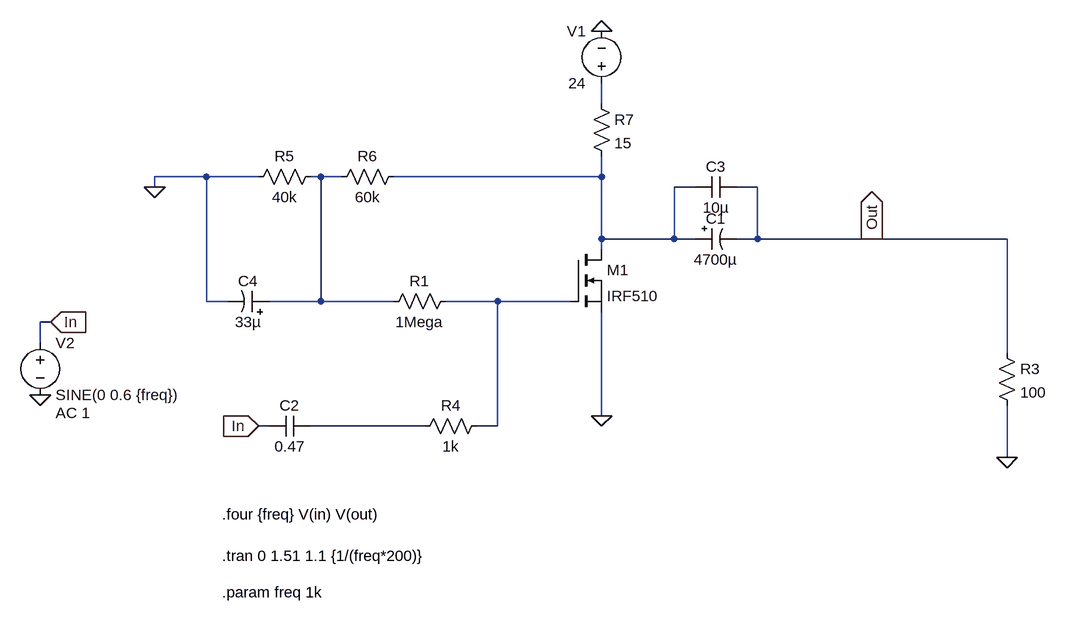
[diagram p0: schematic power_ampv3.asc]
power_ampv3.asc, the LTspice schematic file:
Version 4
SHEET 1 880 680
WIRE -64 -128 -64 -160
WIRE -672 -16 -752 -16
WIRE -592 -16 -672 -16
WIRE -496 -16 -512 -16
WIRE -464 -16 -496 -16
WIRE -64 -16 -64 -48
WIRE -64 -16 -384 -16
WIRE -752 0 -752 -16
WIRE 80 0 48 0
WIRE 176 0 144 0
WIRE -64 80 -64 -16
WIRE 48 80 48 0
WIRE 48 80 -64 80
WIRE 80 80 48 80
WIRE 176 80 176 0
WIRE 176 80 144 80
WIRE 352 80 176 80
WIRE 560 80 352 80
WIRE -64 96 -64 80
WIRE -672 176 -672 -16
WIRE -640 176 -672 176
WIRE -496 176 -496 -16
WIRE -496 176 -576 176
WIRE -384 176 -496 176
WIRE -224 176 -304 176
WIRE -112 176 -224 176
WIRE -912 208 -928 208
WIRE -928 240 -928 208
WIRE 560 256 560 80
WIRE -64 352 -64 192
WIRE -576 368 -592 368
WIRE -336 368 -512 368
WIRE -224 368 -224 176
WIRE -224 368 -256 368
WIRE 560 416 560 336
FLAG -64 -240 0
FLAG 352 80 Out
IOPIN 352 80 Out
FLAG 560 416 0
FLAG -592 368 In
IOPIN -592 368 In
FLAG -912 208 In
IOPIN -912 208 In
FLAG -928 320 0
FLAG -752 0 0
FLAG -64 352 0
DATAFLAG -64 -16 ""
SYMBOL nmos -112 96 R0
SYMATTR InstName M1
SYMATTR Value IRF510
SYMBOL voltage -64 -144 R180
WINDOW 0 24 96 Left 2
WINDOW 3 24 16 Left 2
SYMATTR InstName V1
SYMATTR Value 24
SYMBOL polcap 80 64 M90
WINDOW 0 0 32 VBottom 2
WINDOW 3 32 32 VTop 2
SYMATTR InstName C1
SYMATTR Value 4700µ
SYMBOL res 544 240 R0
SYMATTR InstName R3
SYMATTR Value 100
SYMBOL voltage -928 224 R0
WINDOW 123 24 124 Left 2
WINDOW 39 0 0 Left 0
SYMATTR Value2 AC 1
SYMATTR InstName V2
SYMATTR Value SINE(0 0.6 {freq})
SYMBOL cap -512 352 R90
WINDOW 0 0 32 VBottom 2
WINDOW 3 32 32 VTop 2
SYMATTR InstName C2
SYMATTR Value 0.47
SYMBOL res -240 352 R90
WINDOW 0 0 56 VBottom 2
WINDOW 3 32 56 VTop 2
SYMATTR InstName R4
SYMATTR Value 1k
SYMBOL res -80 -144 R0
SYMATTR InstName R7
SYMATTR Value 15
SYMBOL res -288 160 R90
WINDOW 0 0 56 VBottom 2
WINDOW 3 32 56 VTop 2
SYMATTR InstName R1
SYMATTR Value 1Mega
SYMBOL res -496 -32 R90
WINDOW 0 0 56 VBottom 2
WINDOW 3 32 56 VTop 2
SYMATTR InstName R5
SYMATTR Value 40k
SYMBOL res -368 -32 R90
WINDOW 0 0 56 VBottom 2
WINDOW 3 32 56 VTop 2
SYMATTR InstName R6
SYMATTR Value 60k
SYMBOL polcap -576 192 M270
WINDOW 0 32 32 VTop 2
WINDOW 3 0 32 VBottom 2
SYMATTR InstName C4
SYMATTR Value 33µ
SYMBOL cap 144 -16 R90
WINDOW 0 0 32 VBottom 2
WINDOW 3 32 32 VTop 2
SYMATTR InstName C3
SYMATTR Value 10µ
TEXT -648 568 Left 2 !.tran 0 1.51 1.1 {1/(freq*200)}
TEXT -648 504 Left 2 !.four {freq} V(in) V(out)
TEXT -648 624 Left 2 !.param freq 1k

The netlist it stands for:
* power_ampv3.asc
M1 N003 N004 0 0 IRF510
V1 N001 0 24
C1 N003 Out 4700µ
R3 Out 0 100
V2 In 0 SINE(0 0.6 {freq}) AC 1
C2 N005 In 0.47
R4 N004 N005 1k
R7 N001 N003 15
R1 N004 N002 1Mega
R5 N002 0 40k
R6 N003 N002 60k
C4 N002 0 33µ
C3 Out N003 10µ
.model NMOS NMOS
.model PMOS PMOS
.lib standard.mos
.tran 0 1.51 1.1 {1/(freq*200)}
.four {freq} V(in) V(out)
.param freq 1k
.backanno
.end